# EAGLE schematic v1.1 (EAGLE 5.11)
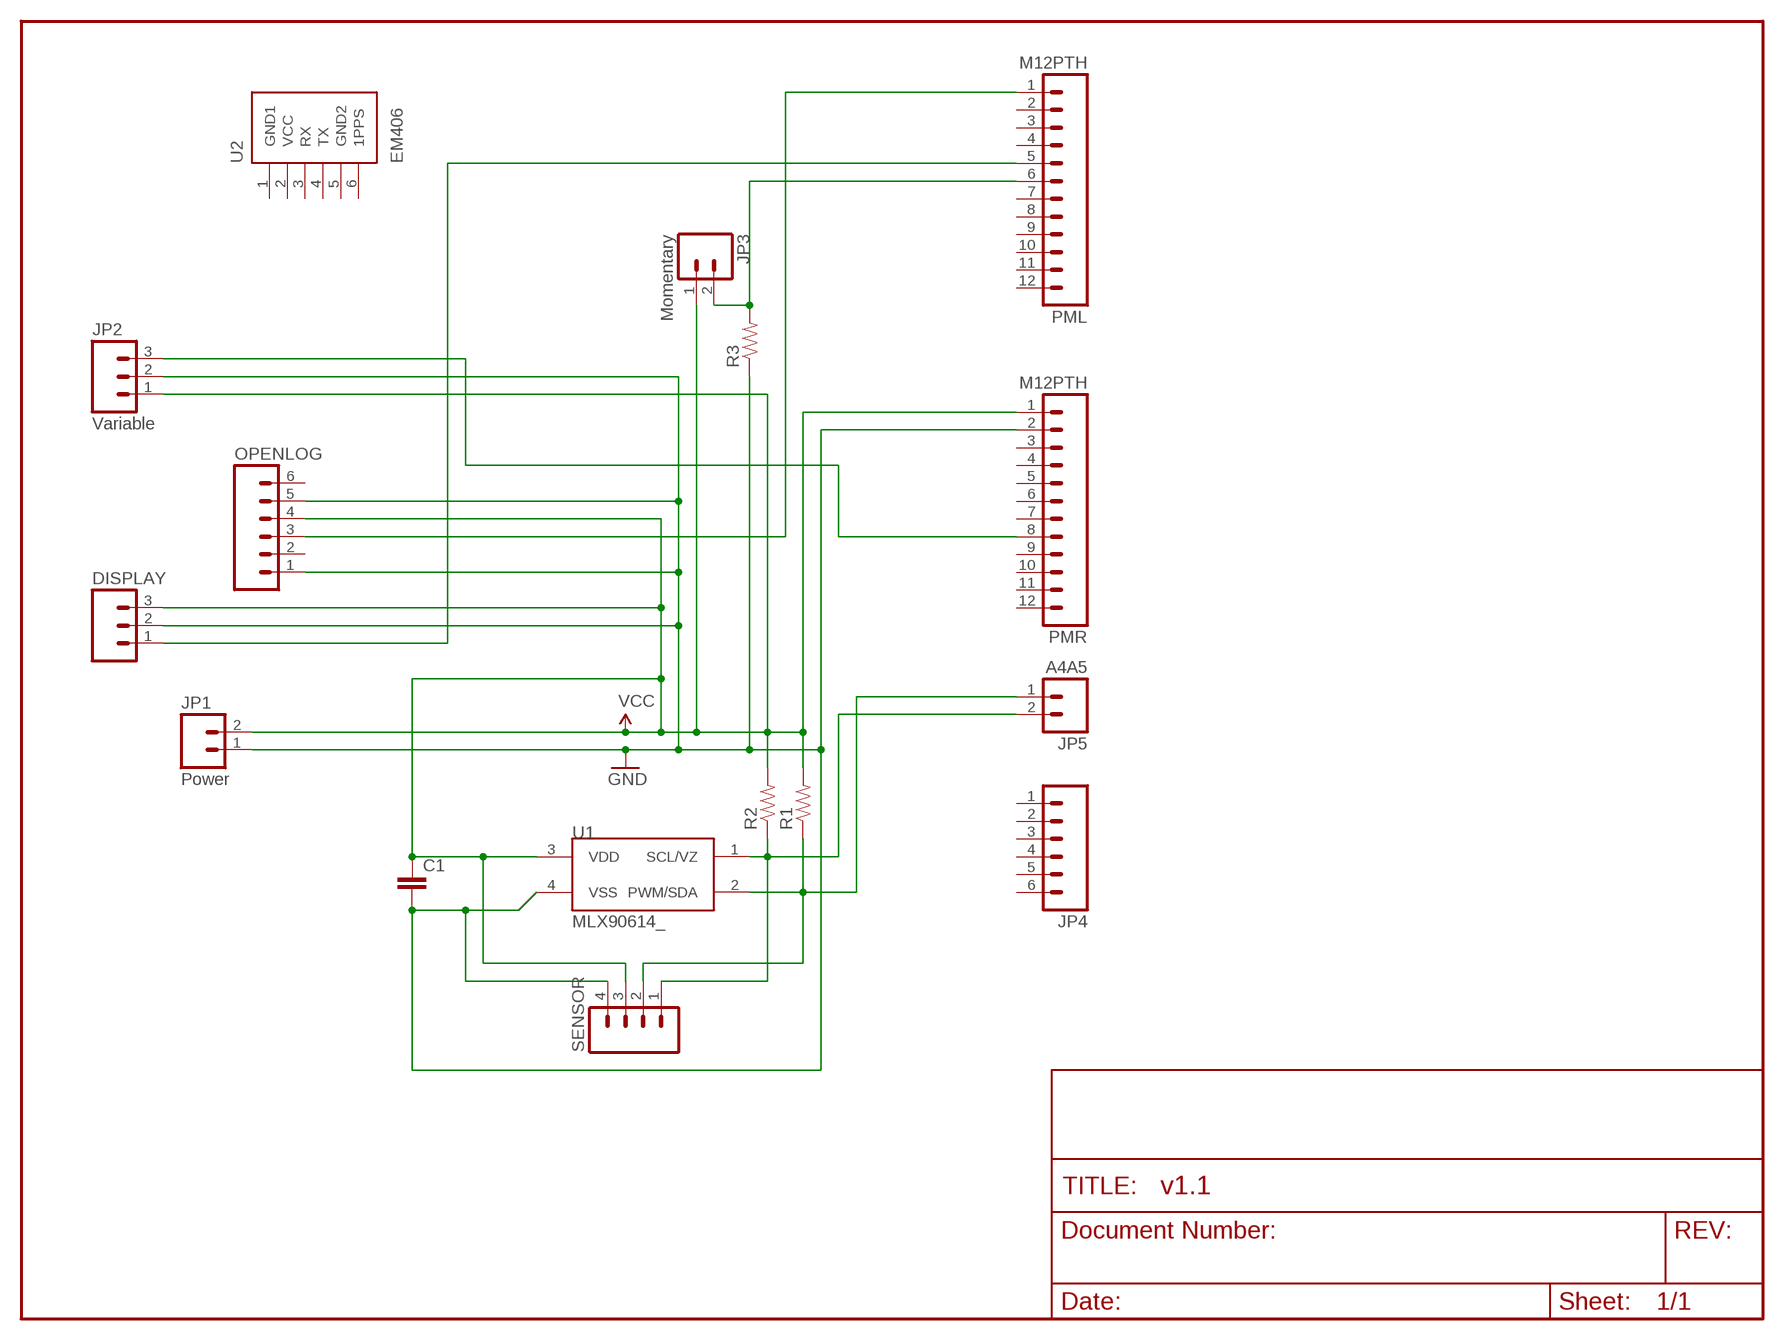
[diagram p0: schematic, sheet 1]

## Parts
C1  CAPPTH3  [CAP-PTH-LARGE]
DISPLAY  M03SCREW_LOCK  [SCREWTERMINAL-3.5MM-3_LOCK.007S]
JP1  Power  M02JST-PTH-2  [JST-2-PTH]
JP2  Variable  M03SCREW_LOCK  [SCREWTERMINAL-3.5MM-3_LOCK.007S]
JP3  Momentary  M02JST-PTH-2  [JST-2-PTH]
JP4  M06SIP  [1X06]
JP5  A4A5  M02PTH  [1X02]
OPENLOG  M06LOCK  [1X06_LOCK]
PML  M12PTH  [1X12]
PMR  M12PTH  [1X12]
R1  RESISTORPTH-1/4W  [AXIAL-0.4]
R2  RESISTORPTH-1/4W  [AXIAL-0.4]
R3  RESISTORPTH-1/4W  [AXIAL-0.4]
SENSOR  M04SCREW_LOCK  [SCREWTERMINAL-3.5MM-4_LOCK]
U1  MLX90614_  [TO-39]
U2  EM406  [EM406]

## Nets
GND: C1.2 DISPLAY.2 JP1.1 JP2.2 OPENLOG.1 OPENLOG.5 PMR.2 R3.P$1 SENSOR.4 U1.4(VSS)
N$1: JP5.2 R2.P$1 SENSOR.1 U1.1(SCL/VZ)
N$2: JP5.1 R1.P$1 SENSOR.2 U1.2(PWM/SDA)
N$3: JP3.2 PML.6 R3.P$2
N$4: DISPLAY.1 PML.5
N$5: JP2.3 PMR.8
N$6: OPENLOG.3 PML.1
VCC: C1.1 DISPLAY.3 JP1.2 JP2.1 JP3.1 OPENLOG.4 PMR.1 R1.P$2 R2.P$2 SENSOR.3 U1.3(VDD)
Unconnected: JP4.1 JP4.2 JP4.3 JP4.4 JP4.5 JP4.6 OPENLOG.2 OPENLOG.6 PML.2 PML.3 PML.4 PML.7 PML.8 PML.9 PML.10 PML.11 PML.12 PMR.3 PMR.4 PMR.5 PMR.6 PMR.7 PMR.9 PMR.10 PMR.11 PMR.12 U2.1(GND1) U2.2(VCC) U2.3(RX) U2.4(TX) U2.5(GND2) U2.6(1PPS)

## Library data of the parts
C1 = SparkFun:CAP: Capacitor Standard 0603 ceramic capacitor, and 0.1" leaded capacitor.
DISPLAY JP2 = SparkFun:M03: Header 3 Standard 3-pin 0.1" header. Use with straight break away headers (SKU : PRT-00116), right angle break away headers (PRT-00553), swiss pins (PRT-00743), machine pins (PRT-00117), and female headers (PRT-00115). Molex polarized connector foot print use with SKU : PRT-08232 with associated crimp pins and housings.
JP1 JP3 JP5 = SparkFun:M02: Header 2 Standard 2-pin 0.1" header. Use with straight break away headers (SKU : PRT-00116), right angle break away headers (PRT-00553), swiss pins (PRT-00743), machine pins (PRT-00117), and female headers (PRT-00115). Molex polarized connector foot print use with SKU : PRT-08233 with associated crimp pins and housings.
JP4 OPENLOG = SparkFun:M06: Header 6 Standard 6-pin 0.1" header. Use with straight break away headers (SKU : PRT-00116), right angle break away headers (PRT-00553), swiss pins (PRT-00743), machine pins (PRT-00117), and female headers (PRT-00115). Molex polarized connector foot print use with SKU : PRT-08094 with associated crimp pins and housings. NOTES ON THE VARIANTS LOCK and LOCK_LONGPADS... This footprint was designed to help hold the alignment of a through-hole component (i.e. 6-pin header) while soldering it into place. You may notice that each hole has been shifted either up or down by 0.005 of an inch from it's more standard position (which is a perfectly straight line). This slight alteration caused the pins (the squares in the middle) to touch the edges of the holes. Because they are alternating, it causes a "brace" to hold the component in place. 0.005 has proven to be the perfect amount of "off-center" position when using our standard breakaway headers. Although looks a little odd when you look at the bare footprint, once you have a header in there, the alteration is very hard to notice. Also, if you push a header all the way into place, it is covered up entirely on the bottom side. This idea of altering the position of holes to aid alignment will be further integrated into the Sparkfun Library for other footprints. It can help hold any component with 3 or more connection pins.
PML PMR = SparkFun:M12: Header 12 Standard 12-pin 0.1" header. Use with straight break away headers (SKU : PRT-00116), right angle break away headers (PRT-00553), swiss pins (PRT-00743), machine pins (PRT-00117), and female headers (PRT-00115).
R1-R3 = SparkFun:RESISTOR: Resistor Basic schematic elements and footprints for 0603, 1206, and PTH resistors.
SENSOR = SparkFun:M04: Header 4 Standard 4-pin 0.1" header. Use with straight break away headers (SKU : PRT-00116), right angle break away headers (PRT-00553), swiss pins (PRT-00743), machine pins (PRT-00117), and female headers (PRT-00115). Molex polarized connector foot print use with SKU : PRT-08231 with associated crimp pins and housings. 1MM SMD Version SKU: PRT-10208
U1 = SparkFun:MLX90614: Melexis IR Thermometer
U2 = SparkFun:EM406: EM406 Connector Proven layout and schematic for EM406 connector. Spark Fun Electronics SKU : GPS-00579